# EAGLE design 1 (EAGLE 8.5.0)
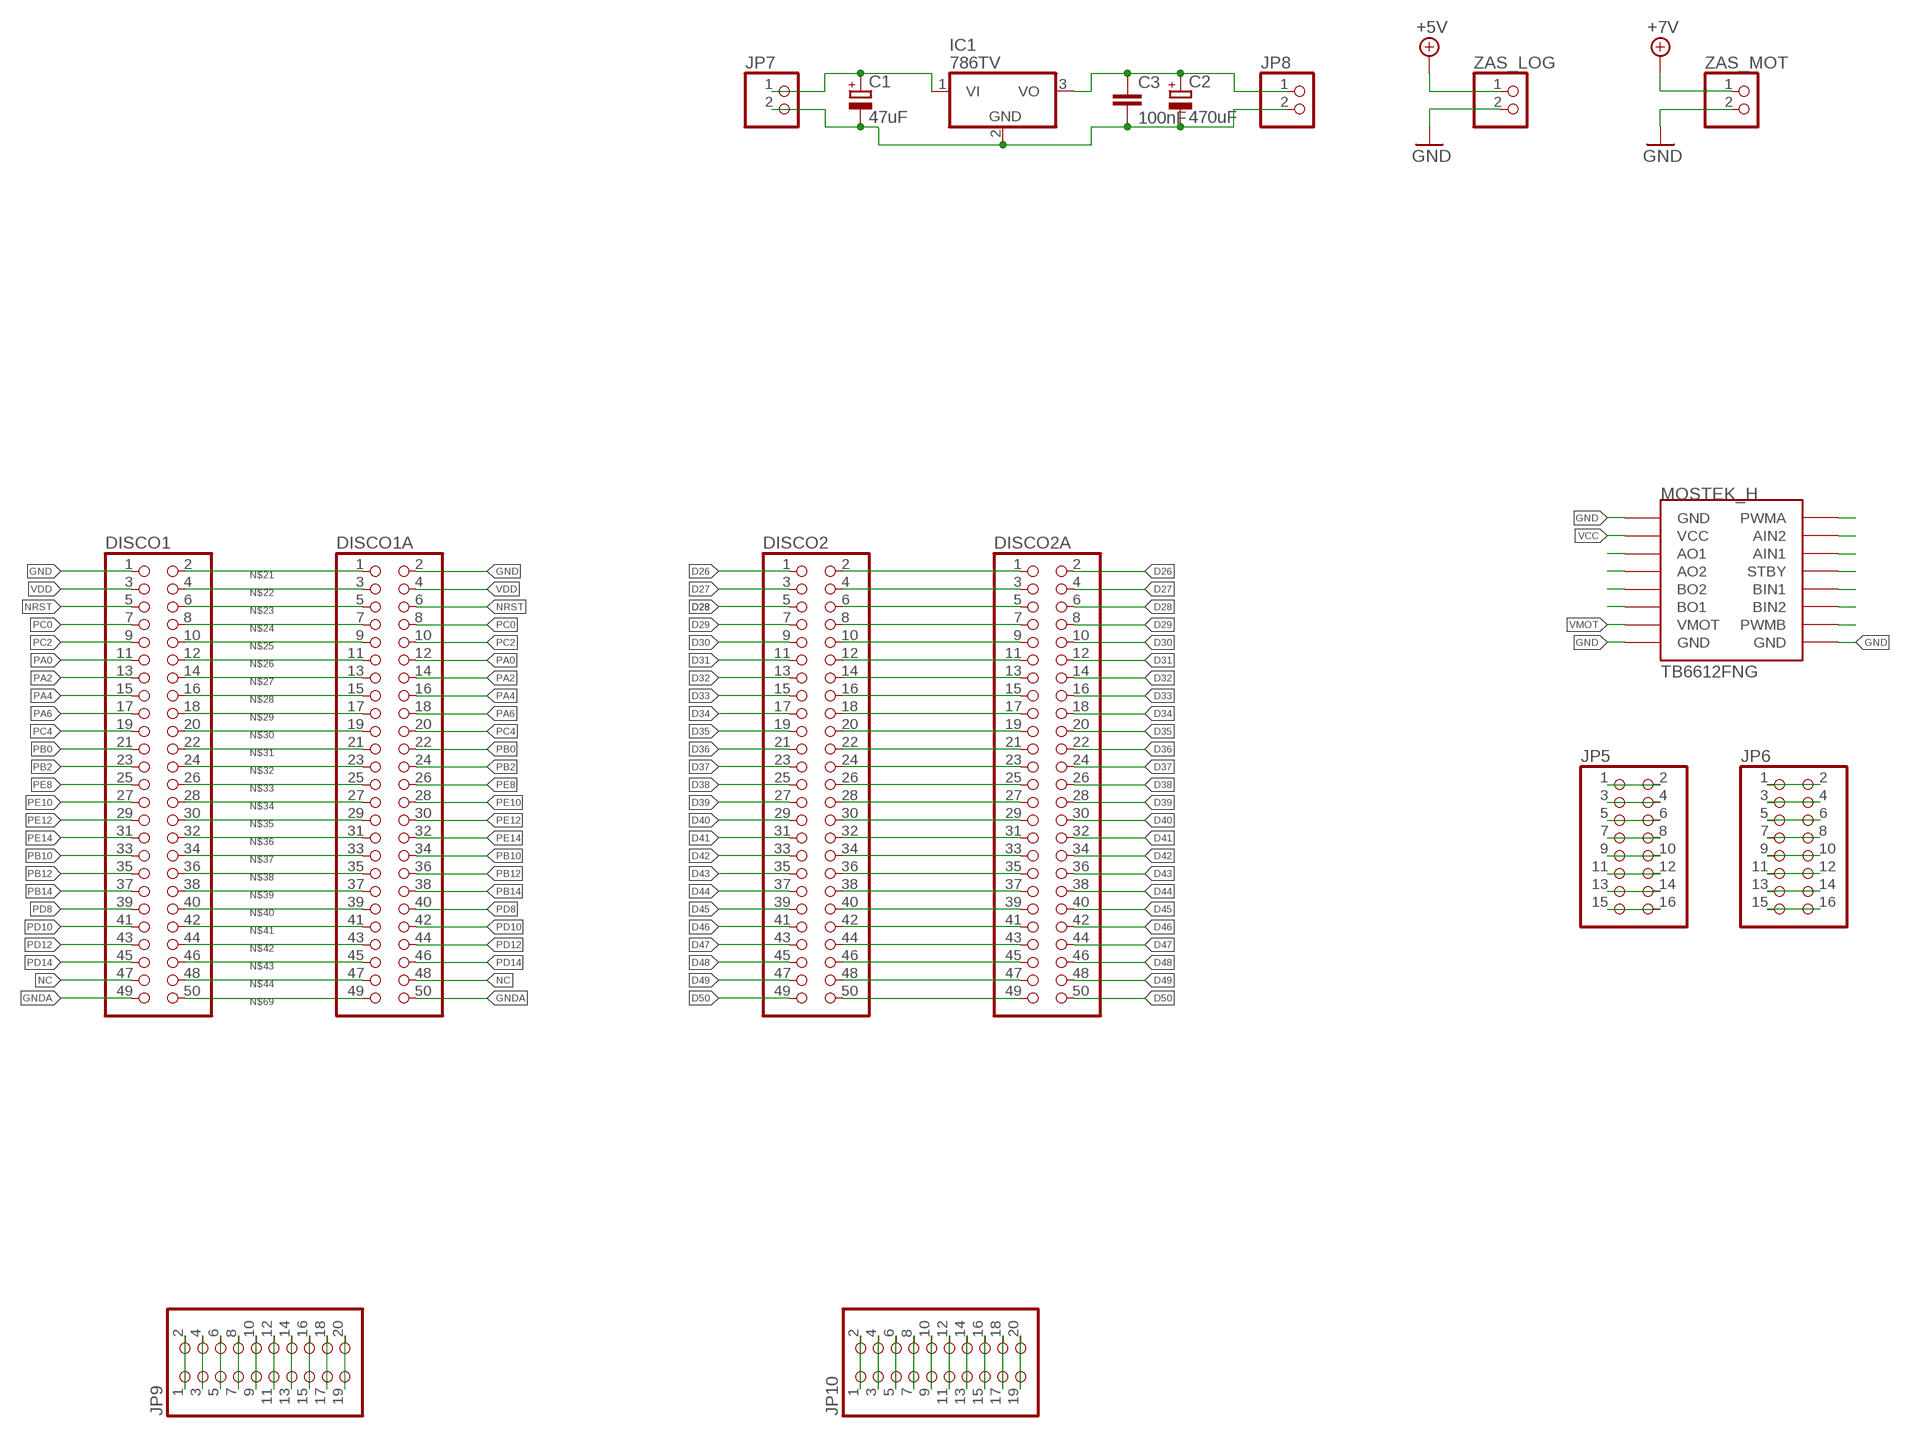
[diagram p0: schematic, sheet 1]

## Parts
C1  47uF  CPOL-EU153CLV-0405  [153CLV-0405]
C2  470uF  CPOL-EU153CLV-0405  [153CLV-0405]
C3  100nF  C-EU025-024X044  [C025-024X044]
DISCO1  PINHD-2X25  [2X25]
DISCO1A  PINHD-2X25  [2X25]
DISCO2  PINHD-2X25  [2X25]
DISCO2A  PINHD-2X25  [2X25]
IC1  786TV  [TO220V]
JP5  PINHD-2X8  [2X08]
JP6  PINHD-2X8  [2X08]
JP7  PINHD-1X2  [1X02]
JP8  PINHD-1X2  [1X02]
JP9  PINHD-2X10  [2X10]
JP10  PINHD-2X10  [2X10]
MOSTEK_H  MODUL_POLOLU  [MODUL_POLOLU]
ZAS_LOG  PINHD-1X2/90  [1X02/90]
ZAS_MOT  PINHD-1X2/90  [1X02/90]

## Nets
+5V: ZAS_LOG.1
D26: DISCO2.1 DISCO2A.2
D27: DISCO2.3 DISCO2A.4
D28: DISCO2.5 DISCO2A.6
D29: DISCO2.7 DISCO2A.8
D30: DISCO2.9 DISCO2A.10
D31: DISCO2.11 DISCO2A.12
D32: DISCO2.13 DISCO2A.14
D33: DISCO2.15 DISCO2A.16
D34: DISCO2.17 DISCO2A.18
D35: DISCO2.19 DISCO2A.20
D36: DISCO2.21 DISCO2A.22
D37: DISCO2.23 DISCO2A.24
D38: DISCO2.25 DISCO2A.26
D39: DISCO2.27 DISCO2A.28
D40: DISCO2.29 DISCO2A.30
D41: DISCO2.31 DISCO2A.32
D42: DISCO2.33 DISCO2A.34
D43: DISCO2.35 DISCO2A.36
D44: DISCO2.37 DISCO2A.38
D45: DISCO2.39 DISCO2A.40
D46: DISCO2.41 DISCO2A.42
D47: DISCO2.43 DISCO2A.44
D48: DISCO2.45 DISCO2A.46
D49: DISCO2.47 DISCO2A.48
D50: DISCO2.49 DISCO2A.50
GND: DISCO1.1 DISCO1A.2 MOSTEK_H.GND1(GND) MOSTEK_H.GND2(GND) MOSTEK_H.GND3(GND) ZAS_LOG.2 ZAS_MOT.2
GNDA: DISCO1.49 DISCO1A.50
N$1: JP5.1 JP5.2
N$2: JP5.3 JP5.4
N$3: JP5.5 JP5.6
N$4: JP5.7 JP5.8
N$5: JP5.9 JP5.10
N$6: JP5.11 JP5.12
N$7: JP5.13 JP5.14
N$8: JP5.15 JP5.16
N$9: JP6.1 JP6.2
N$10: JP6.3 JP6.4
N$11: JP6.5 JP6.6
N$12: JP6.7 JP6.8
N$13: JP6.9 JP6.10
N$14: JP6.11 JP6.12
N$15: JP6.13 JP6.14
N$16: JP6.15 JP6.16
N$17: C1.+ IC1.1(VI) JP7.1
N$18: C2.+ C3.1 IC1.3(VO) JP8.1
N$19: C1.- C2.- C3.2 IC1.2(GND) JP7.2 JP8.2
N$21: DISCO1.2 DISCO1A.1
N$22: DISCO1.4 DISCO1A.3
N$23: DISCO1.6 DISCO1A.5
N$24: DISCO1.8 DISCO1A.7
N$25: DISCO1.10 DISCO1A.9
N$26: DISCO1.12 DISCO1A.11
N$27: DISCO1.14 DISCO1A.13
N$28: DISCO1.16 DISCO1A.15
N$29: DISCO1.18 DISCO1A.17
N$30: DISCO1.20 DISCO1A.19
N$31: DISCO1.22 DISCO1A.21
N$32: DISCO1.24 DISCO1A.23
N$33: DISCO1.26 DISCO1A.25
N$34: DISCO1.28 DISCO1A.27
N$35: DISCO1.30 DISCO1A.29
N$36: DISCO1.32 DISCO1A.31
N$37: DISCO1.34 DISCO1A.33
N$38: DISCO1.36 DISCO1A.35
N$39: DISCO1.38 DISCO1A.37
N$40: DISCO1.40 DISCO1A.39
N$41: DISCO1.42 DISCO1A.41
N$42: DISCO1.44 DISCO1A.43
N$43: DISCO1.46 DISCO1A.45
N$44: DISCO1.48 DISCO1A.47
N$46: MOSTEK_H.AO1
N$47: MOSTEK_H.A02(AO2)
N$48: MOSTEK_H.BO2
N$49: MOSTEK_H.BO1
N$53: MOSTEK_H.PWMB
N$54: MOSTEK_H.BIN2
N$55: MOSTEK_H.BIN1
N$56: MOSTEK_H.STBY
N$57: MOSTEK_H.AIN1
N$58: MOSTEK_H.AIN2
N$59: MOSTEK_H.PWMA
N$69: DISCO1.50 DISCO1A.49
N$70: DISCO2.2 DISCO2A.1
N$71: DISCO2.4 DISCO2A.3
N$72: DISCO2.6 DISCO2A.5
N$73: DISCO2.8 DISCO2A.7
N$74: DISCO2.10 DISCO2A.9
N$75: DISCO2.12 DISCO2A.11
N$76: DISCO2.14 DISCO2A.13
N$77: DISCO2.16 DISCO2A.15
N$78: DISCO2.18 DISCO2A.17
N$79: DISCO2.20 DISCO2A.19
N$80: DISCO2.22 DISCO2A.21
N$81: DISCO2.24 DISCO2A.23
N$82: DISCO2.26 DISCO2A.25
N$83: DISCO2.28 DISCO2A.27
N$84: DISCO2.30 DISCO2A.29
N$85: DISCO2.32 DISCO2A.31
N$86: DISCO2.34 DISCO2A.33
N$87: DISCO2.36 DISCO2A.35
N$88: DISCO2.38 DISCO2A.37
N$89: DISCO2.40 DISCO2A.39
N$90: DISCO2.42 DISCO2A.41
N$91: DISCO2.44 DISCO2A.43
N$92: DISCO2.46 DISCO2A.45
N$93: DISCO2.48 DISCO2A.47
N$119: DISCO2.50 DISCO2A.49
N$120: JP9.1 JP9.2
N$121: JP9.3 JP9.4
N$122: JP9.5 JP9.6
N$123: JP9.7 JP9.8
N$124: JP9.9 JP9.10
N$125: JP9.11 JP9.12
N$126: JP9.13 JP9.14
N$127: JP9.15 JP9.16
N$128: JP9.17 JP9.18
N$129: JP9.19 JP9.20
N$130: JP10.1 JP10.2
N$131: JP10.3 JP10.4
N$132: JP10.5 JP10.6
N$133: JP10.7 JP10.8
N$134: JP10.9 JP10.10
N$135: JP10.11 JP10.12
N$136: JP10.13 JP10.14
N$137: JP10.15 JP10.16
N$138: JP10.17 JP10.18
N$139: JP10.19 JP10.20
NC: DISCO1.47 DISCO1A.48
NRST: DISCO1.5 DISCO1A.6
PA0: DISCO1.11 DISCO1A.12
PA2: DISCO1.13 DISCO1A.14
PA4: DISCO1.15 DISCO1A.16
PA6: DISCO1.17 DISCO1A.18
PB0: DISCO1.21 DISCO1A.22
PB2: DISCO1.23 DISCO1A.24
PB10: DISCO1.33 DISCO1A.34
PB12: DISCO1.35 DISCO1A.36
PB14: DISCO1.37 DISCO1A.38
PC0: DISCO1.7 DISCO1A.8
PC2: DISCO1.9 DISCO1A.10
PC4: DISCO1.19 DISCO1A.20
PD8: DISCO1.39 DISCO1A.40
PD10: DISCO1.41 DISCO1A.42
PD12: DISCO1.43 DISCO1A.44
PD14: DISCO1.45 DISCO1A.46
PE8: DISCO1.25 DISCO1A.26
PE10: DISCO1.27 DISCO1A.28
PE12: DISCO1.29 DISCO1A.30
PE14: DISCO1.31 DISCO1A.32
VCC: MOSTEK_H.VCC
VDD: DISCO1.3 DISCO1A.4
VMOT: MOSTEK_H.VMOT ZAS_MOT.1 ; supply symbol labelled +7V

## Library data of the parts
C1 C2 = rcl:CPOL-EU: POLARIZED CAPACITOR, European symbol
C3 = rcl:C-EU: CAPACITOR, European symbol
DISCO1 DISCO1A DISCO2 DISCO2A = pinhead:PINHD-2X25: PIN HEADER
IC1 = linear:78*: Positive VOLTAGE REGULATOR Source: http://cache.national.com/ds/LM/LM78L05.pdf http://www.fairchildsemi.com/ds/LM/LM7805.pdf
JP5 JP6 = pinhead:PINHD-2X8: PIN HEADER
JP7 JP8 ZAS_LOG ZAS_MOT = pinhead:PINHD-1X2: PIN HEADER
JP9 JP10 = pinhead:PINHD-2X10: PIN HEADER
MOSTEK_H = TB6612FNG:MODUL_POLOLU

## Board
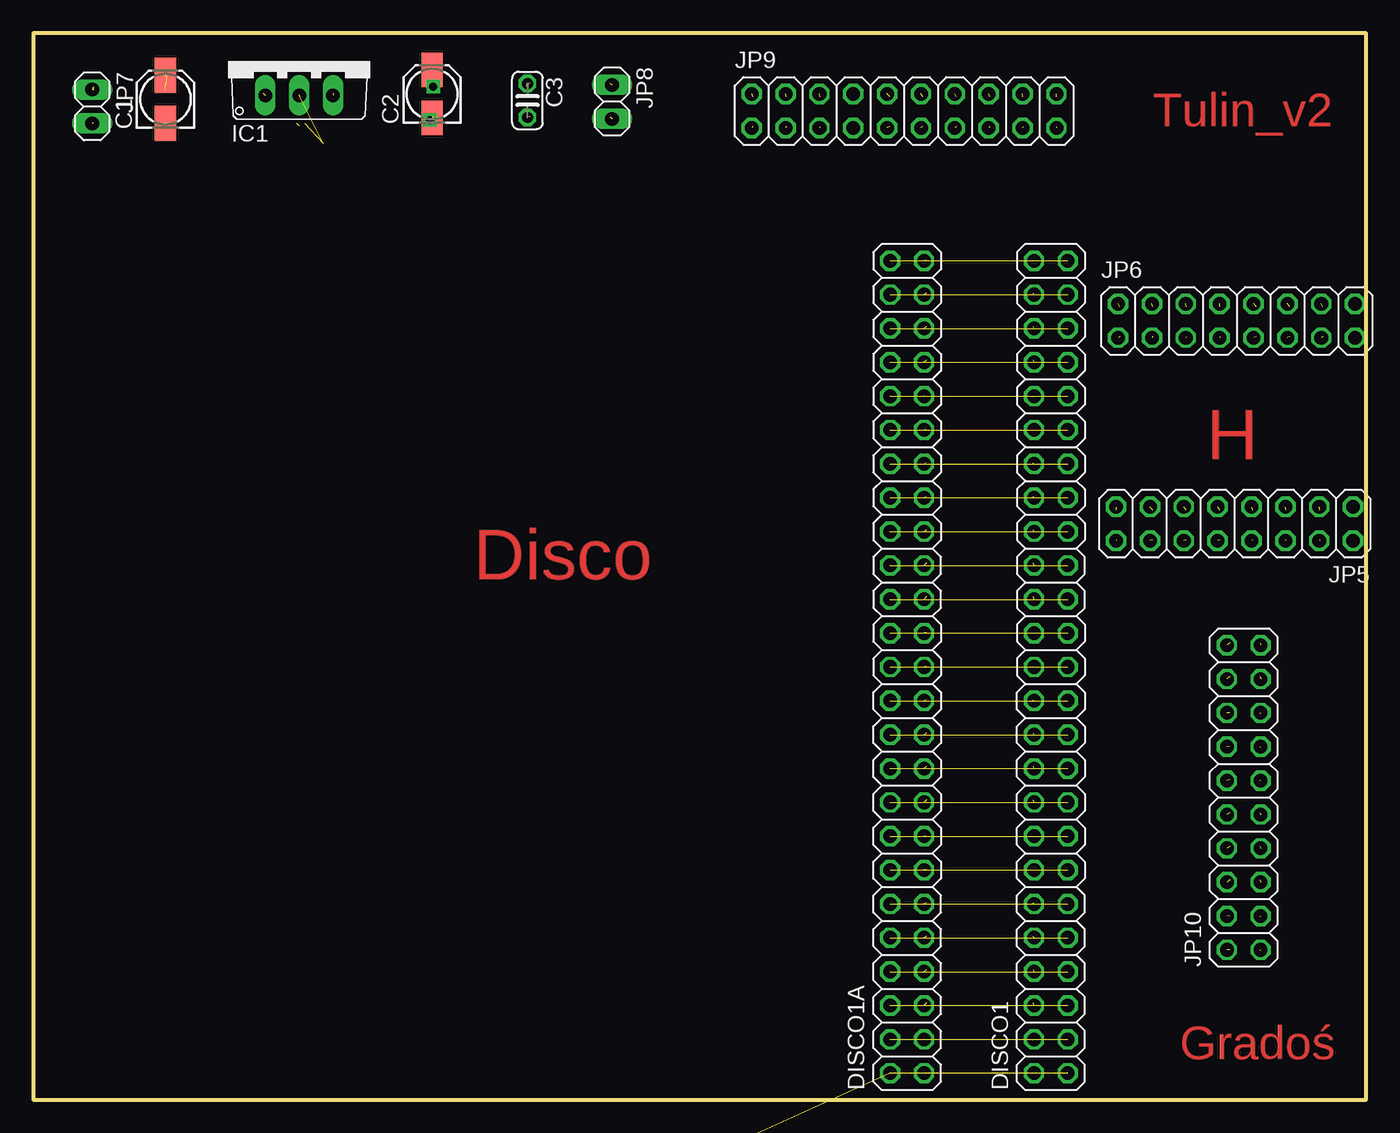
[diagram p1: board, top side]
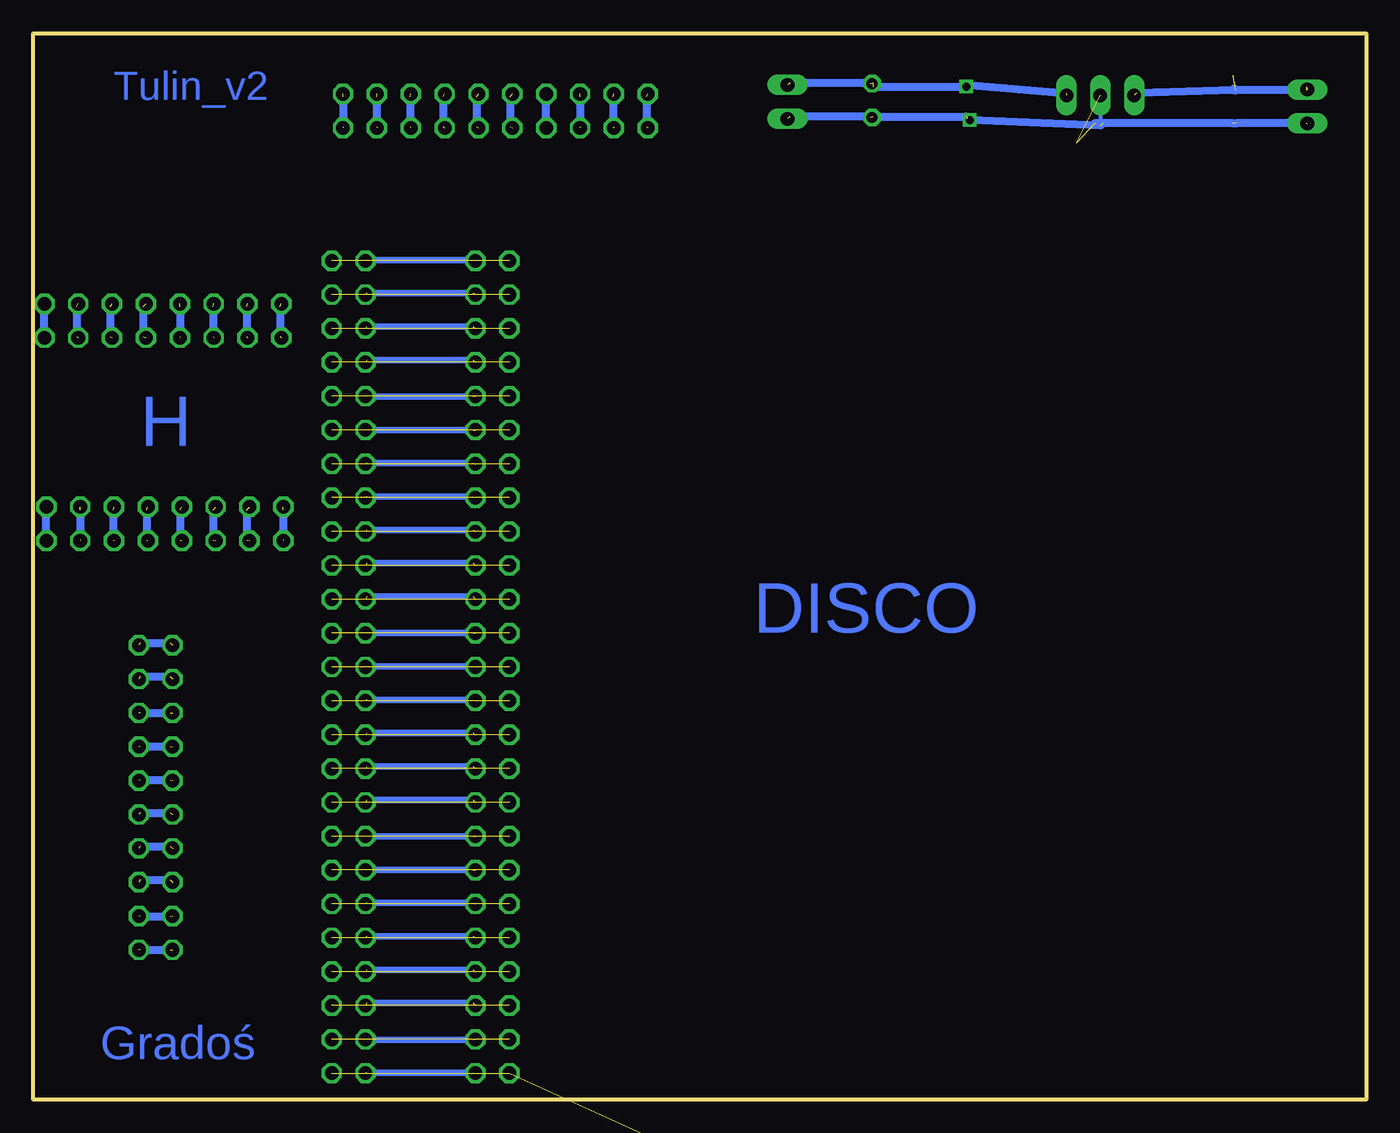
[diagram p2: board, bottom side, seen from below]

Size 100 x 80 mm. Coordinates in mm from the lower left corner, seen from the top.
Outline: 0,0 100,0 100,80 0,80 0,0
Copper layers (1*16): Top 0.035mm / dielectric 1.5mm / Bottom 0.035mm
Design rules "default": minimum track width 10mil, minimum drill 24mil, track to track 8mil, track to pad 8mil, pad to pad 8mil, via to via 8mil, smd to smd 8mil, copper to edge 40mil, drill to drill 8mil, minimum pad ring 10mil, minimum via ring 8mil, stop-mask expansion 4mil, vias tented up to drill 0mil, thermal gap 10mil

### Footprints (pad centres in the part's own frame; a part is rotated, then mirrored left to right if it is on the bottom)
153CLV-0405 = smd 2.6 x 1.6: + 1.8,0; - -1.8,0
C025-024X044 = drill 0.813 octagon: 1 -1.27,0; 2 1.27,0
2X25 = drill 1.016 octagon: 1 -30.48,-1.27; 2 -30.48,1.27; 3 -27.94,-1.27; 4 -27.94,1.27; 5 -25.4,-1.27; 6 -25.4,1.27; 7 -22.86,-1.27; 8 -22.86,1.27; 9 -20.32,-1.27; 10 -20.32,1.27; 11 -17.78,-1.27; 12 -17.78,1.27; 13 -15.24,-1.27; 14 -15.24,1.27; 15 -12.7,-1.27; 16 -12.7,1.27; 17 -10.16,-1.27; 18 -10.16,1.27; 19 -7.62,-1.27; 20 -7.62,1.27; 21 -5.08,-1.27; 22 -5.08,1.27; 23 -2.54,-1.27; 24 -2.54,1.27; 25 0,-1.27; 26 0,1.27; 27 2.54,-1.27; 28 2.54,1.27; 29 5.08,-1.27; 30 5.08,1.27; 31 7.62,-1.27; 32 7.62,1.27; 33 10.16,-1.27; 34 10.16,1.27; 35 12.7,-1.27; 36 12.7,1.27; 37 15.24,-1.27; 38 15.24,1.27; 39 17.78,-1.27; 40 17.78,1.27; 41 20.32,-1.27; 42 20.32,1.27; 43 22.86,-1.27; 44 22.86,1.27; 45 25.4,-1.27; 46 25.4,1.27; 47 27.94,-1.27; 48 27.94,1.27; 49 30.48,-1.27; 50 30.48,1.27
TO220V = drill 1.016 long: 1 -2.54,-2.54; 2 0,-2.54; 3 2.54,-2.54
2X08 = drill 1.016 octagon: 1 -8.89,-1.27; 2 -8.89,1.27; 3 -6.35,-1.27; 4 -6.35,1.27; 5 -3.81,-1.27; 6 -3.81,1.27; 7 -1.27,-1.27; 8 -1.27,1.27; 9 1.27,-1.27; 10 1.27,1.27; 11 3.81,-1.27; 12 3.81,1.27; 13 6.35,-1.27; 14 6.35,1.27; 15 8.89,-1.27; 16 8.89,1.27
1X02 = drill 1.016 long: 1 -1.27,0; 2 1.27,0
2X10 = drill 1.016 octagon: 1 -11.43,-1.27; 2 -11.43,1.27; 3 -8.89,-1.27; 4 -8.89,1.27; 5 -6.35,-1.27; 6 -6.35,1.27; 7 -3.81,-1.27; 8 -3.81,1.27; 9 -1.27,-1.27; 10 -1.27,1.27; 11 1.27,-1.27; 12 1.27,1.27; 13 3.81,-1.27; 14 3.81,1.27; 15 6.35,-1.27; 16 6.35,1.27; 17 8.89,-1.27; 18 8.89,1.27; 19 11.43,-1.27; 20 11.43,1.27
MODUL_POLOLU = drill 1 pad 1.778 octagon: A02 -6.35,1.27; AIN1 6.35,3.81; AIN2 6.35,6.35; AO1 -6.35,3.81; BIN1 6.35,-1.27; BIN2 6.35,-3.81; BO1 -6.35,-3.81; BO2 -6.35,-1.27; GND1 -6.35,8.89; GND2 -6.35,-8.89; GND3 6.35,-8.89; PWMA 6.35,8.89; PWMB 6.35,-6.35; STBY 6.35,1.27; VCC -6.35,6.35; VMOT -6.35,-6.35
1X02/90 = drill 1.016 long: 1 -1.27,-3.81; 2 1.27,-3.81

### Placement (x,y rotation side)
C1  9.92,75.06 90 top
C2  29.92,75.44 90 top
C3  37.07,74.96 270 top
DISCO1  76.34,32.45 90 top
DISCO1A  65.56,32.45 90 top
DISCO2  35,-33 0 top  (outside the outline)
DISCO2A  35,-15 0 top  (outside the outline)
IC1  19.95,77.89 0 top
JP5  90.13,43.2 180 top
JP6  90.28,58.44 0 top
JP7  4.42,74.51 270 top
JP8  43.42,74.86 270 top
JP9  65.33,74.18 0 top
JP10  90.82,22.66 90 top
MOSTEK_H  -19,-24 0 top  (outside the outline)
ZAS_LOG  -44,-30 0 top  (outside the outline)
ZAS_MOT  -62,-30 0 top  (outside the outline)

### Tracks (layer width: path | path; a pad name or v marks a point on that pad's centre or on a via)
D26  (1 unrouted)
D27  (1 unrouted)
D28  (1 unrouted)
D29  (1 unrouted)
D30  (1 unrouted)
D31  (1 unrouted)
D32  (1 unrouted)
D33  (1 unrouted)
D34  (1 unrouted)
D35  (1 unrouted)
D36  (1 unrouted)
D37  (1 unrouted)
D38  (1 unrouted)
D39  (1 unrouted)
D40  (1 unrouted)
D41  (1 unrouted)
D42  (1 unrouted)
D43  (1 unrouted)
D44  (1 unrouted)
D45  (1 unrouted)
D46  (1 unrouted)
D47  (1 unrouted)
D48  (1 unrouted)
D49  (1 unrouted)
D50  (1 unrouted)
GND  (6 unrouted)
GNDA  (1 unrouted)
N$1
  Bottom 0.61: JP5.2 JP5.1
N$2  (4 unrouted)
  Bottom 0.61: 96.5,44.25 96.5,42
N$3  (4 unrouted)
  Bottom 0.61: 94,44.25 94,42
N$4  (4 unrouted)
  Bottom 0.61: 91.5,44.25 91.5,42
N$5  (4 unrouted)
  Bottom 0.61: 89,44.25 89,42
N$6  (4 unrouted)
  Bottom 0.61: 86.5,44.25 86.5,42
N$7  (4 unrouted)
  Bottom 0.61: 84,44.25 84,42
N$8  (4 unrouted)
  Bottom 0.61: 81.25,44.25 81.25,42
N$9  (4 unrouted)
  Bottom 0.61: 81.5,59.5 81.5,57.25
N$10  (4 unrouted)
  Bottom 0.61: 84,59.5 84,57.25
N$11  (4 unrouted)
  Bottom 0.61: 86.5,59.5 86.5,57.25
N$12  (4 unrouted)
  Bottom 0.61: 89,59.5 89,57.25
N$13  (4 unrouted)
  Bottom 0.61: 91.75,59.5 91.75,57.25
N$14  (4 unrouted)
  Bottom 0.61: 94.25,59.5 94.25,57.25
N$15  (4 unrouted)
  Bottom 0.61: 96.75,59.5 96.75,57.25
N$16
  Bottom 0.61: JP6.15 JP6.16
N$17  (8 unrouted)
  Bottom 0.61: 4.5,75.75 9.75,75.75 9.92,75.86 | 9.83,75.73 17.25,75.5
N$18  (via drill 0.6)  (10 unrouted)
  Top 0.61: v30,76 C2.+ 29.75,77 30.1,76.15
  Bottom 0.61: 37,76 v30,76 | 30.1,76.15 22.5,75.5 | 37.25,76.25 43.25,76.25
N$19  (via drill 0.6)  (22 unrouted)
  Top 0.61: v29.75,73.5 C2.-
  Bottom 0.305: 20,75.25 19.94,73.08 20,73.25
  Bottom 0.61: 37,73.75 30,73.75 | 37.25,73.75 43.25,73.75 | 4.5,73.25 9.75,73.25 | 10,73.25 20.37,73.25 | 19.94,73.08 v29.75,73.5 | 20,73.25 19.75,73.25
N$21  (4 unrouted)
  Bottom 0.5: 75,2 67,2
N$22  (4 unrouted)
  Bottom 0.5: 75,4.5 67,4.5
N$23  (4 unrouted)
  Bottom 0.5: 75,7.25 67,7.25
N$24  (4 unrouted)
  Bottom 0.5: 75,9.75 67,9.75
N$25  (4 unrouted)
  Bottom 0.5: 75,12.25 67,12.25
N$26  (4 unrouted)
  Bottom 0.5: 75,14.75 67,14.75
N$27  (4 unrouted)
  Bottom 0.5: 75,17.25 67,17.25
N$28  (4 unrouted)
  Bottom 0.5: 75,19.75 67,19.75
N$29  (4 unrouted)
  Bottom 0.5: 75,22.5 67,22.5
N$30  (4 unrouted)
  Bottom 0.5: 75,25 67,25
N$31  (4 unrouted)
  Bottom 0.5: 75,27.5 67,27.5
N$32  (4 unrouted)
  Bottom 0.5: 75,30 67,30
N$33  (4 unrouted)
  Bottom 0.5: 75,32.5 67,32.5
N$34  (4 unrouted)
  Bottom 0.5: 75,35 67,35
N$35  (4 unrouted)
  Bottom 0.5: 75,37.75 67,37.75
N$36  (4 unrouted)
  Bottom 0.5: 75,40.25 67,40.25
N$37  (4 unrouted)
  Bottom 0.5: 75,42.75 67,42.75
N$38  (4 unrouted)
  Bottom 0.5: 75,45.25 67,45.25
N$39  (4 unrouted)
  Bottom 0.5: 75,47.75 67,47.75
N$40  (4 unrouted)
  Bottom 0.5: 75,50.25 67,50.25
N$41  (4 unrouted)
  Bottom 0.5: 75,52.75 67,52.75
N$42  (4 unrouted)
  Bottom 0.5: 75,55.5 67,55.5
N$43  (4 unrouted)
  Bottom 0.5: 75,58 67,58
N$44  (4 unrouted)
  Bottom 0.5: 75,60.5 67,60.5
N$69  (4 unrouted)
  Bottom 0.5: 75,63 67,63
N$70  (1 unrouted)
N$71  (1 unrouted)
N$72  (1 unrouted)
N$73  (1 unrouted)
N$74  (1 unrouted)
N$75  (1 unrouted)
N$76  (1 unrouted)
N$77  (1 unrouted)
N$78  (1 unrouted)
N$79  (1 unrouted)
N$80  (1 unrouted)
N$81  (1 unrouted)
N$82  (1 unrouted)
N$83  (1 unrouted)
N$84  (1 unrouted)
N$85  (1 unrouted)
N$86  (1 unrouted)
N$87  (1 unrouted)
N$88  (1 unrouted)
N$89  (1 unrouted)
N$90  (1 unrouted)
N$91  (1 unrouted)
N$92  (1 unrouted)
N$93  (1 unrouted)
N$119  (1 unrouted)
N$120  (4 unrouted)
  Bottom 0.61: 54,75.25 54,73
N$121  (4 unrouted)
  Bottom 0.61: 56.5,75.25 56.5,73
N$122  (4 unrouted)
  Bottom 0.61: 59,75.25 59,73
N$123
  Bottom 0.61: JP9.7 JP9.8
N$124  (4 unrouted)
  Bottom 0.61: 64.25,75.25 64.25,73
N$125  (4 unrouted)
  Bottom 0.61: 66.75,75.25 66.75,73
N$126  (4 unrouted)
  Bottom 0.61: 69.25,75.25 69.25,73
N$127  (4 unrouted)
  Bottom 0.61: 71.75,75.25 71.75,73
N$128  (4 unrouted)
  Bottom 0.61: 74.25,75.25 74.25,73
N$129  (4 unrouted)
  Bottom 0.61: 76.75,75.25 76.75,73
N$130  (4 unrouted)
  Bottom 0.61: 92,11.25 89.75,11.25
N$131  (4 unrouted)
  Bottom 0.61: 92,13.75 89.75,13.75
N$132  (4 unrouted)
  Bottom 0.61: 92,16.5 89.75,16.5
N$133  (4 unrouted)
  Bottom 0.61: 92,19 89.75,19
N$134  (4 unrouted)
  Bottom 0.61: 92,21.5 89.75,21.5
N$135  (4 unrouted)
  Bottom 0.61: 92,24 89.75,24
N$136  (4 unrouted)
  Bottom 0.61: 92,26.5 89.75,26.5
N$137  (4 unrouted)
  Bottom 0.61: 92,29 89.75,29
N$138  (4 unrouted)
  Bottom 0.61: 92,31.75 89.75,31.75
N$139  (4 unrouted)
  Bottom 0.61: 92,34.25 89.75,34.25
NC  (1 unrouted)
NRST  (1 unrouted)
PA0  (1 unrouted)
PA2  (1 unrouted)
PA4  (1 unrouted)
PA6  (1 unrouted)
PB0  (1 unrouted)
PB2  (1 unrouted)
PB10  (1 unrouted)
PB12  (1 unrouted)
PB14  (1 unrouted)
PC0  (1 unrouted)
PC2  (1 unrouted)
PC4  (1 unrouted)
PD8  (1 unrouted)
PD10  (1 unrouted)
PD12  (1 unrouted)
PD14  (1 unrouted)
PE8  (1 unrouted)
PE10  (1 unrouted)
PE12  (1 unrouted)
PE14  (1 unrouted)
VDD  (1 unrouted)
VMOT  (1 unrouted)

### Text on the board
Top: Tulin_v2 | H | Disco | Gradoś
Bottom: Tulin_v2 | H | DISCO | Gradoś